# EAGLE schematic rep_ctrlr (EAGLE 6.2)
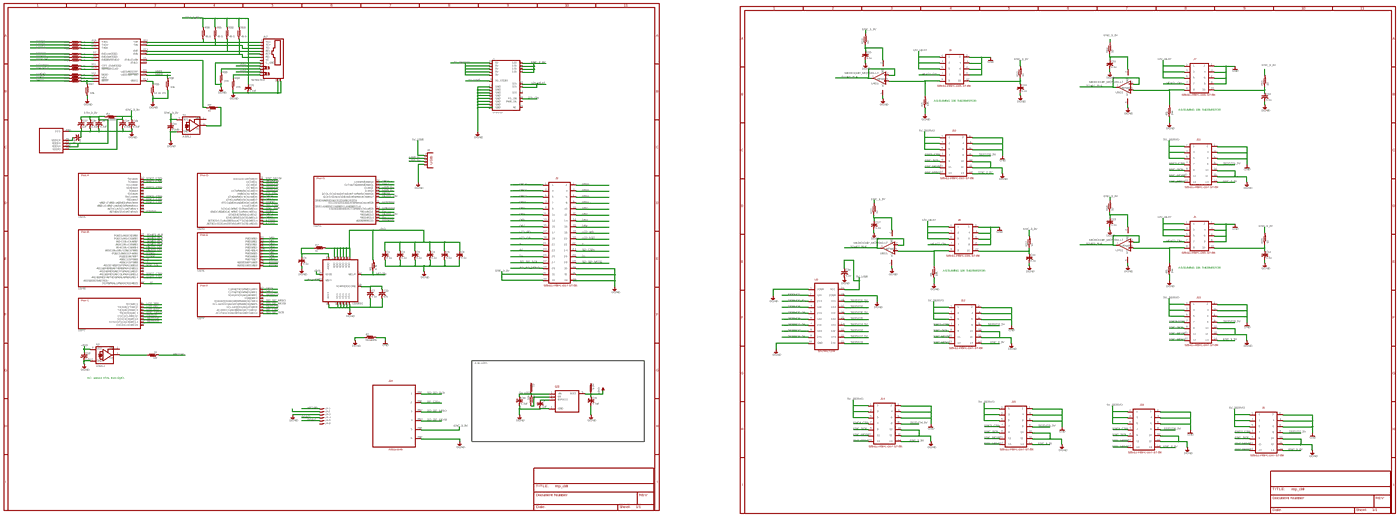
[diagram p0: schematic, sheet 1, overview]
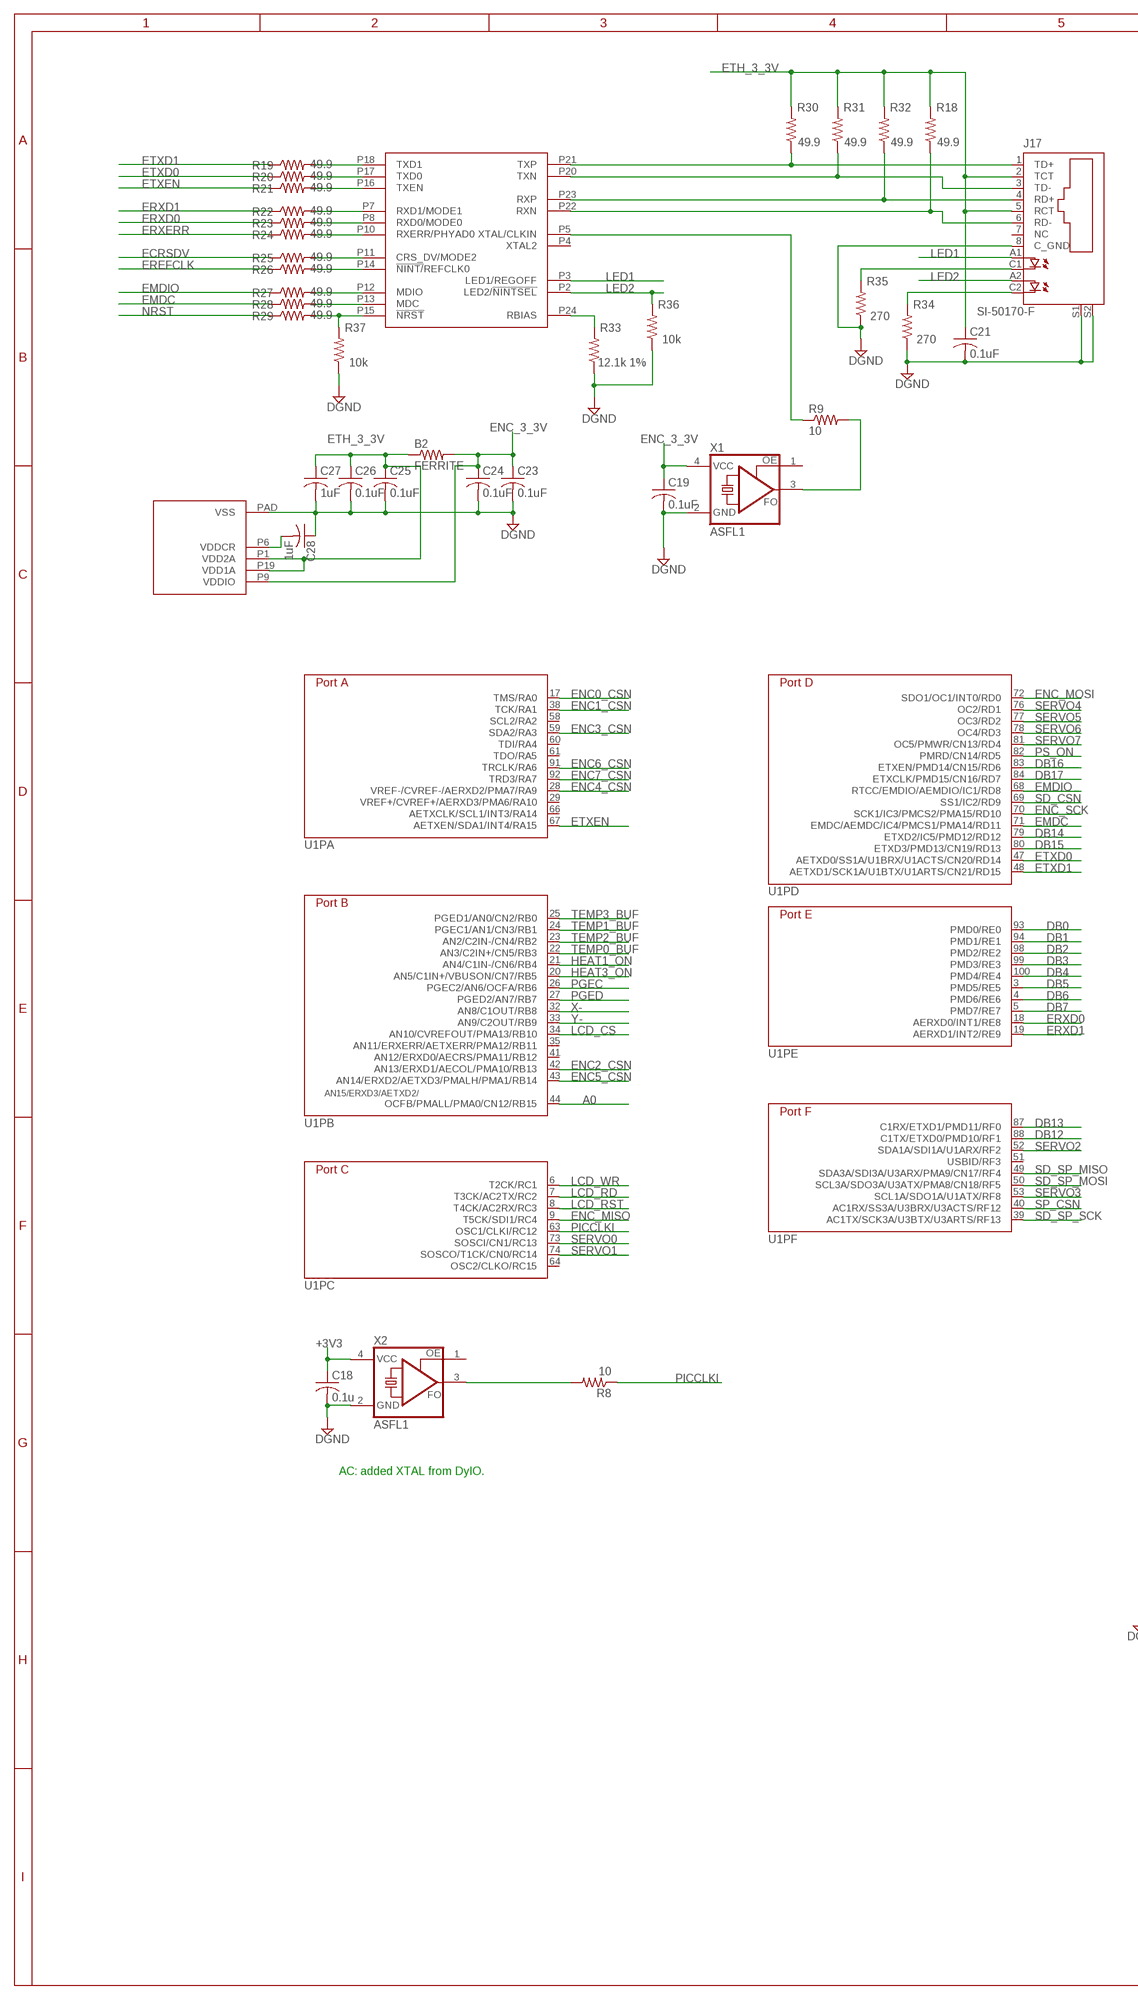
[diagram p1: schematic, sheet 1, part 1 of 4]
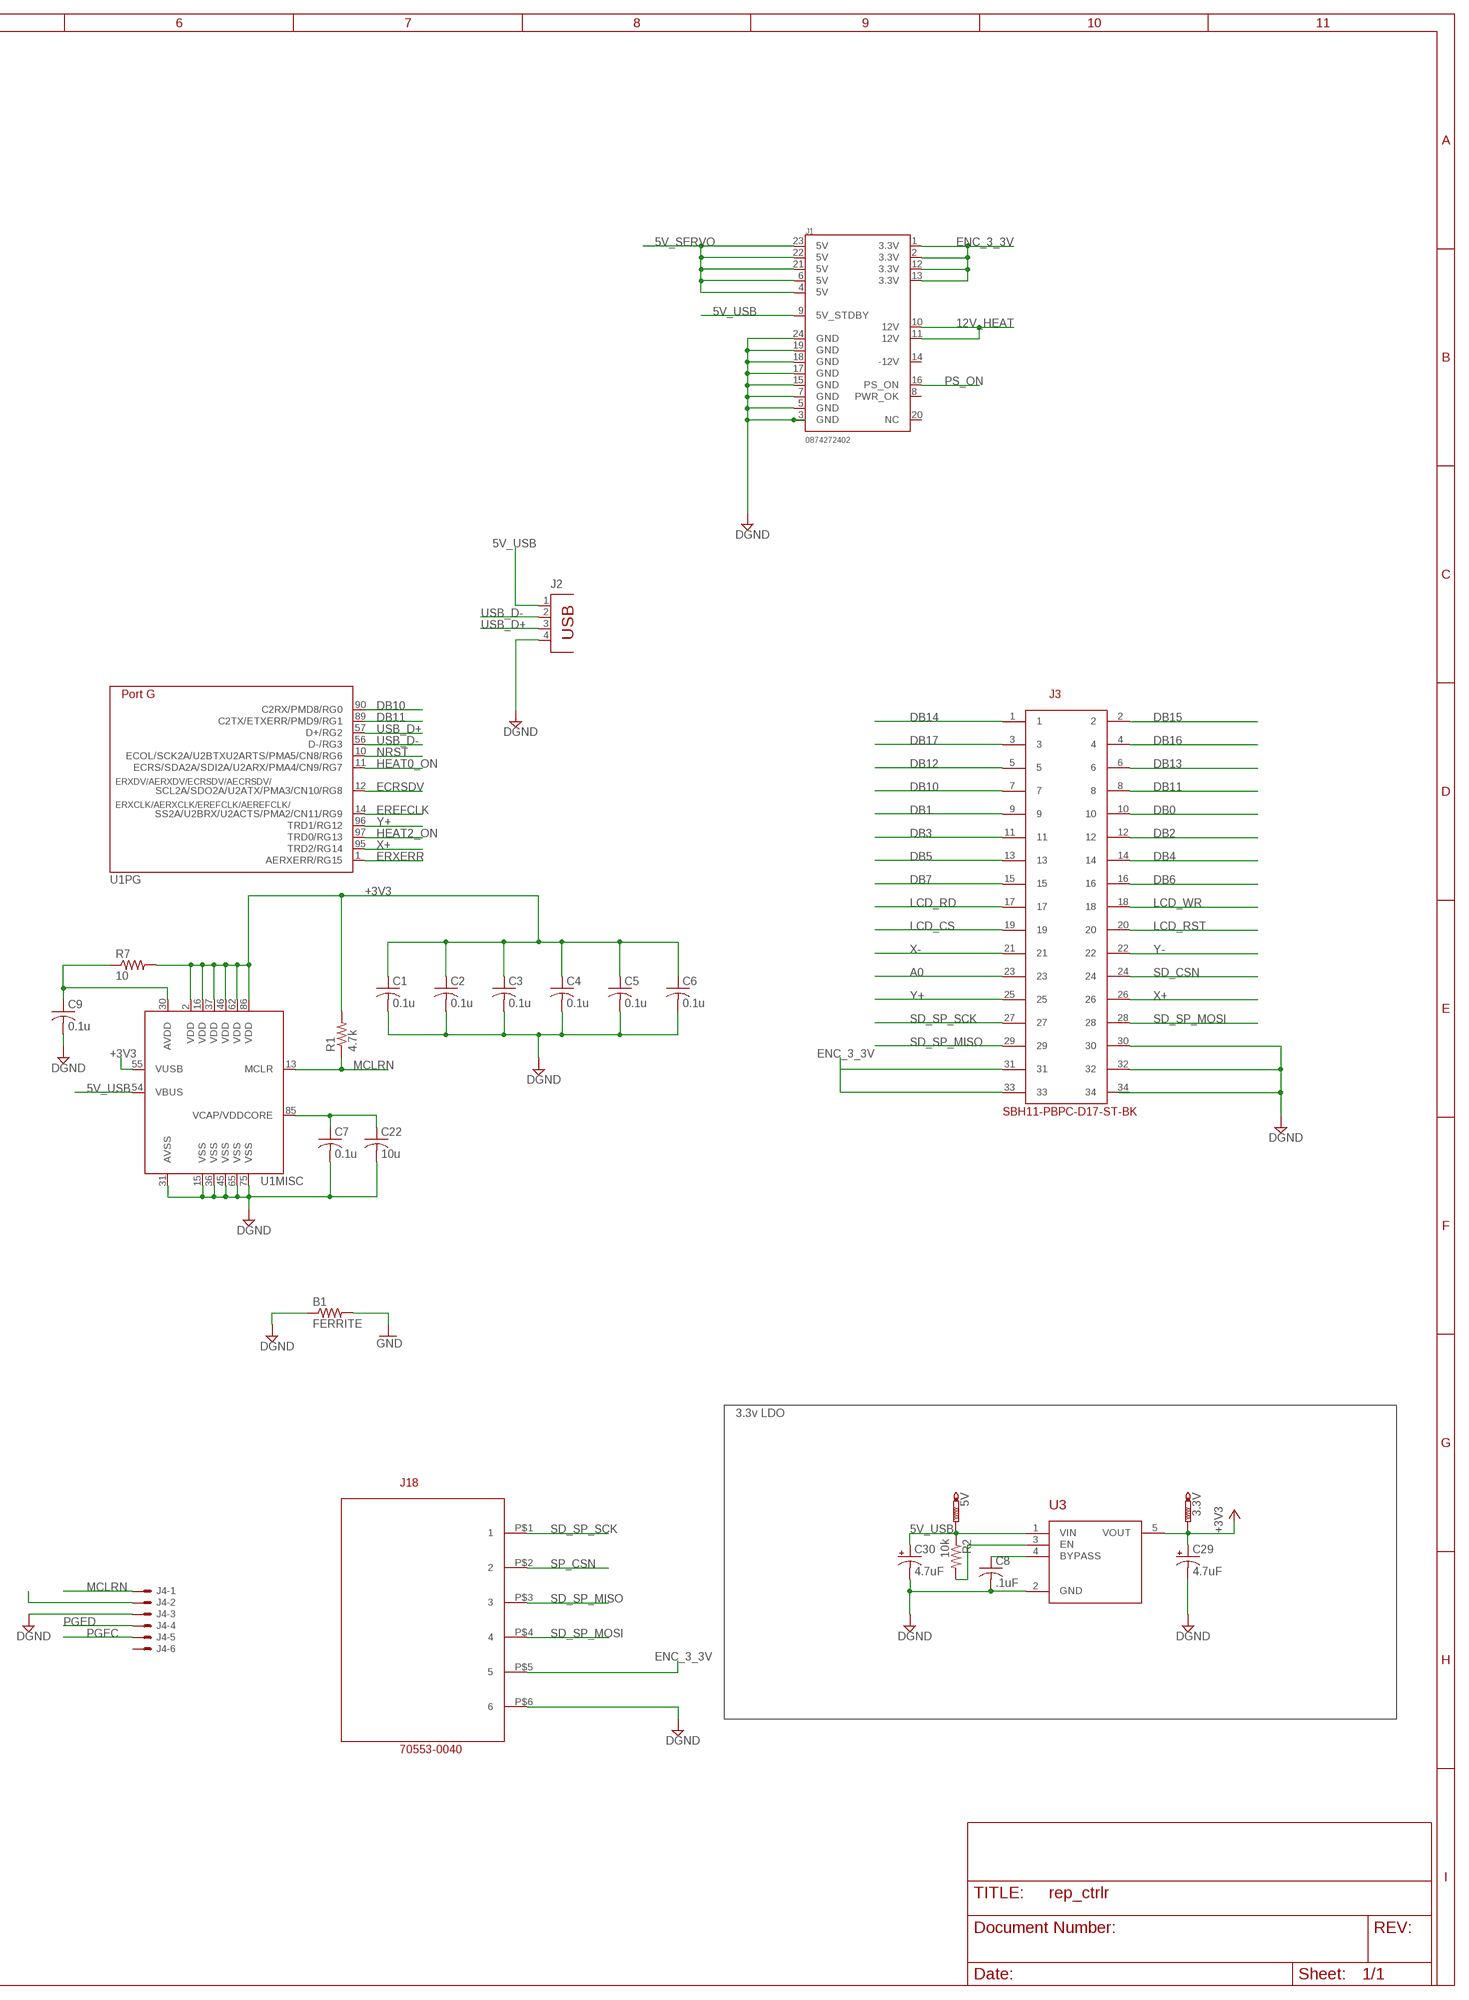
[diagram p2: schematic, sheet 1, part 2 of 4]
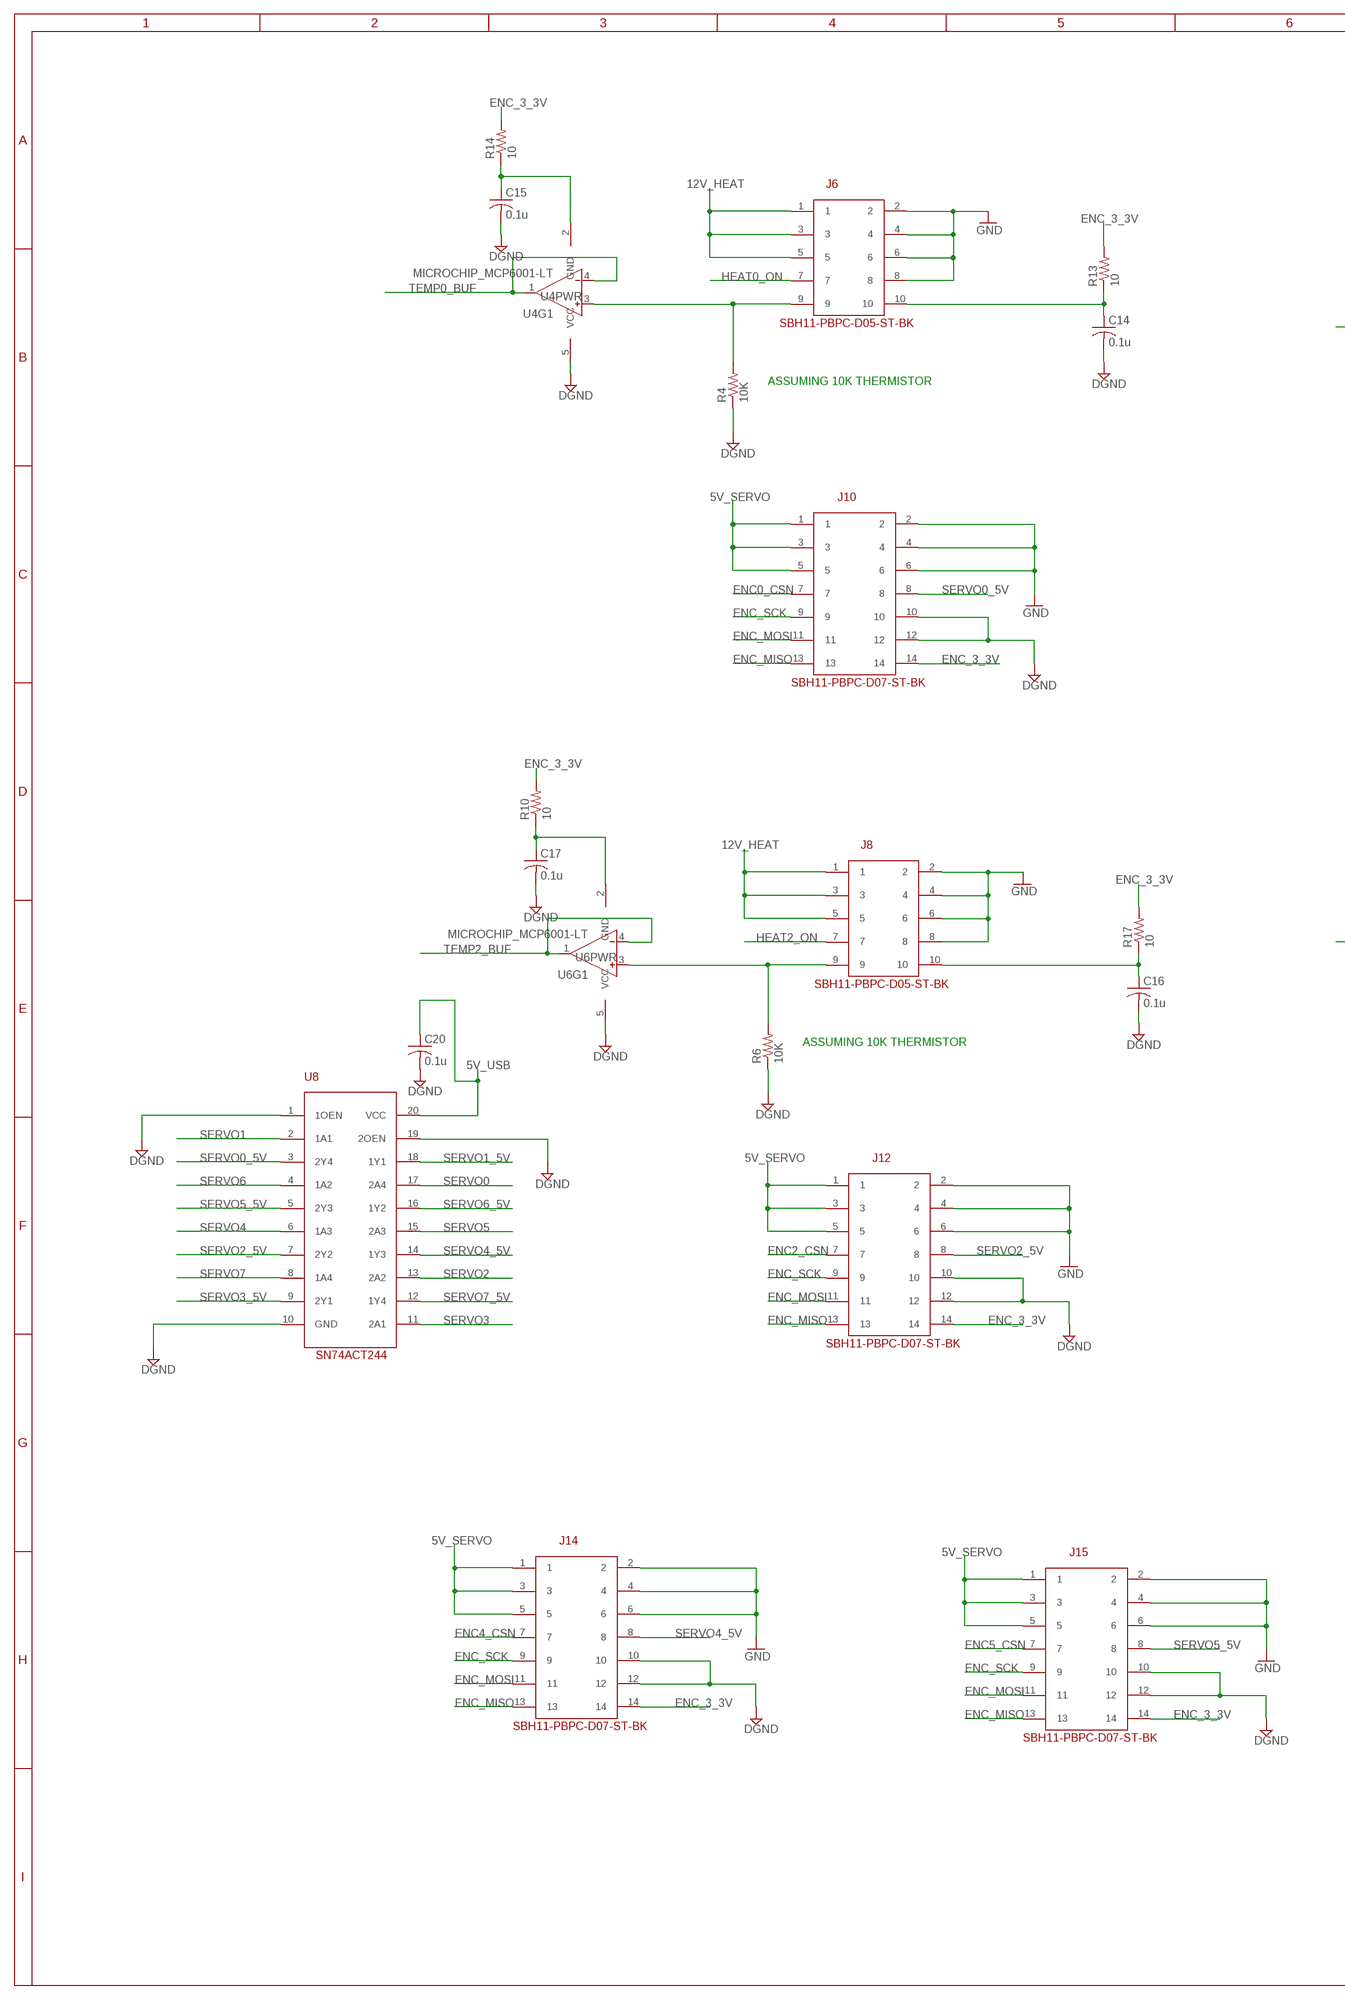
[diagram p3: schematic, sheet 1, part 3 of 4]
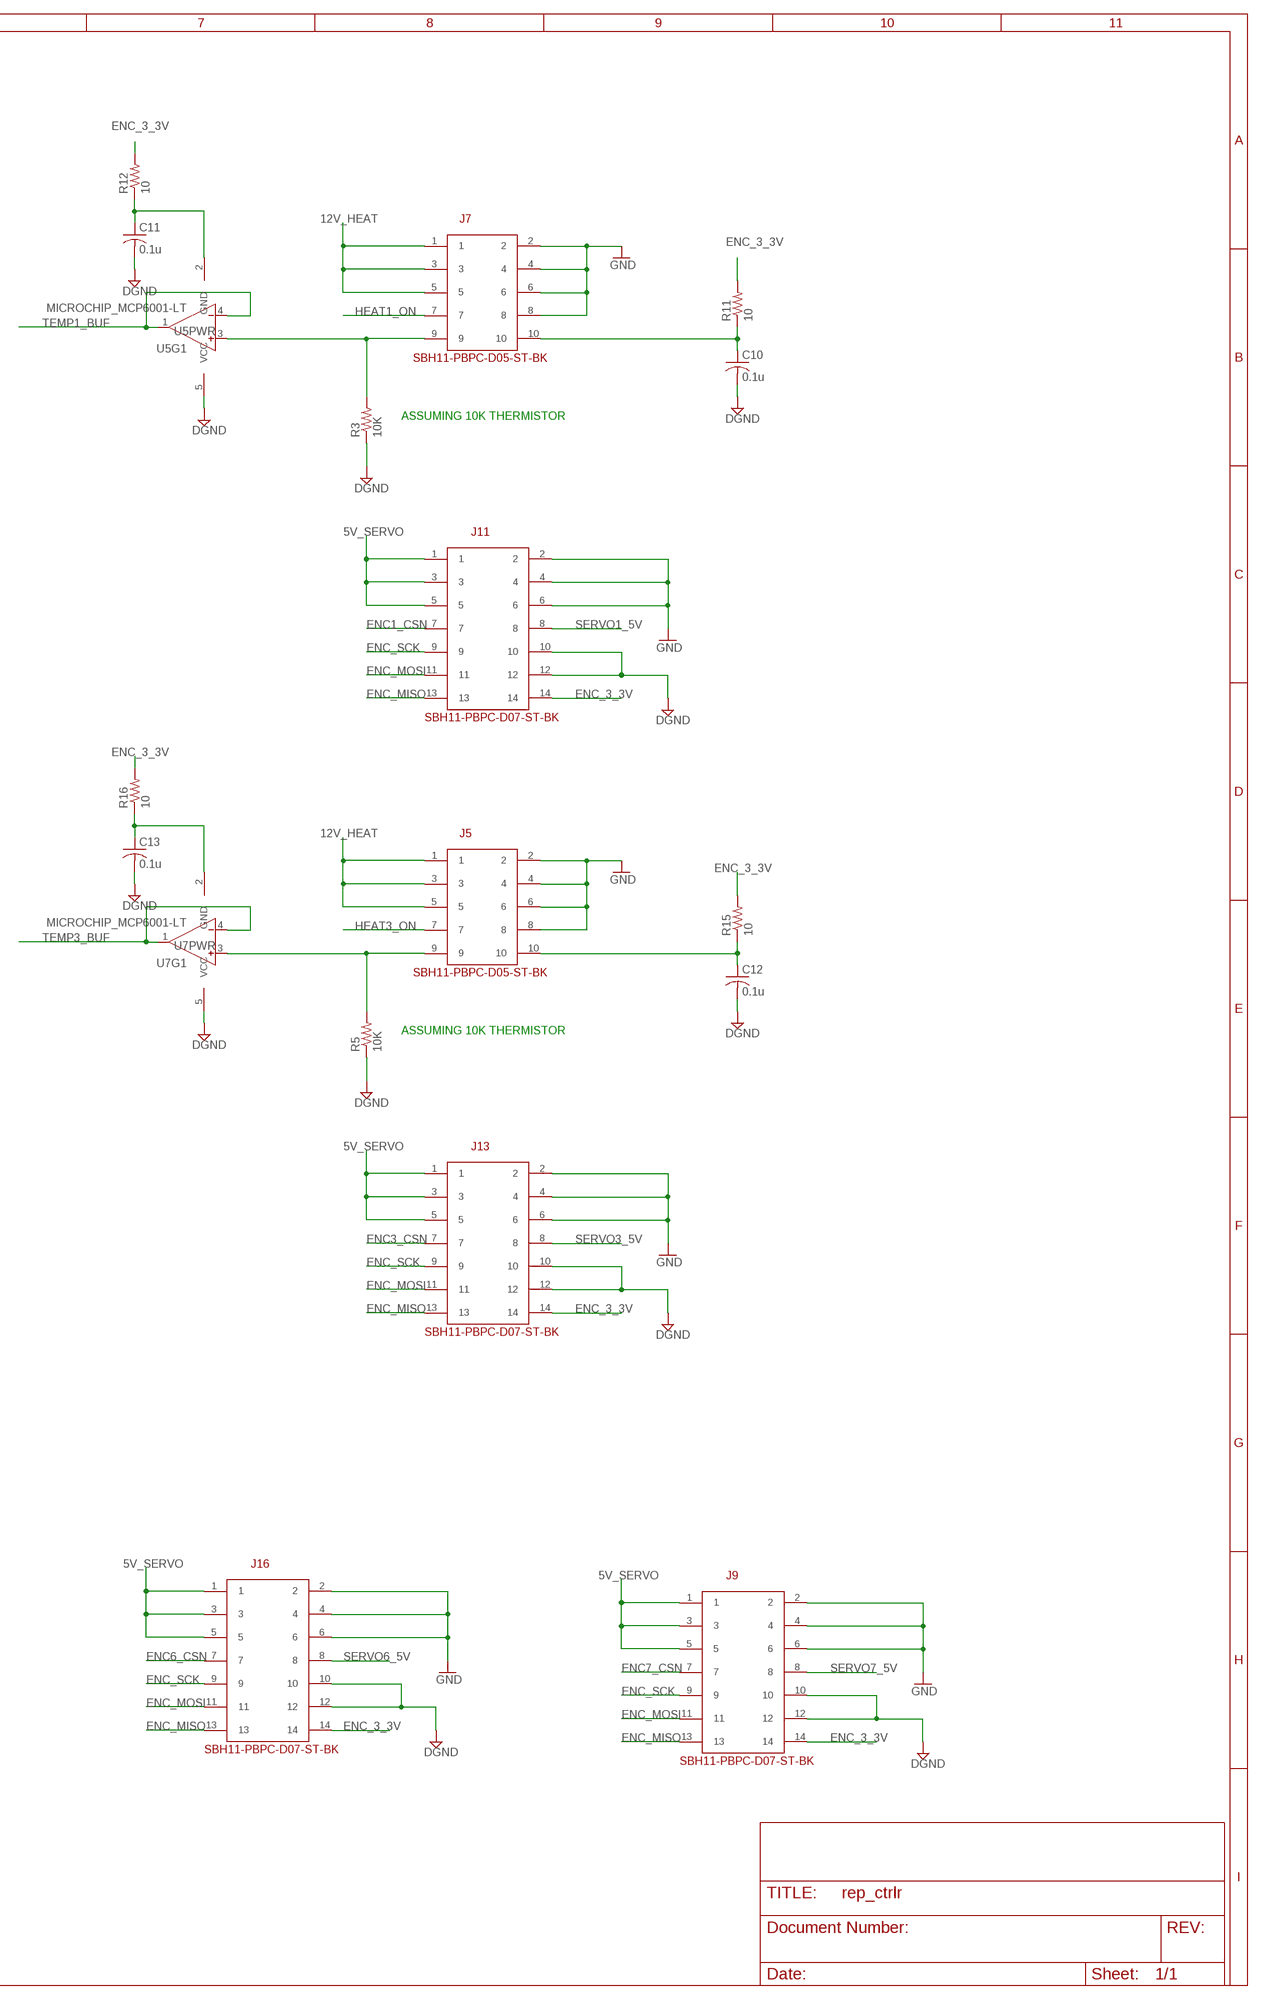
[diagram p4: schematic, sheet 1, part 4 of 4]

## Parts
3.3V  PTR1TP14R  [TP14R]
5V  PTR1TP14R  [TP14R]
B1  FERRITE  R-US_R0805  [R0805]
B2  FERRITE  R-US_R0805  [R0805]
C1  0.1u  C-USC0402  [C0402]
C2  0.1u  C-USC0402  [C0402]
C3  0.1u  C-USC0402  [C0402]
C4  0.1u  C-USC0402  [C0402]
C5  0.1u  C-USC0402  [C0402]
C6  0.1u  C-USC0402  [C0402]
C7  0.1u  C-USC0402  [C0402]
C8  .1uF  C-USC0402  [C0402@1]
C9  0.1u  C-USC0402  [C0402]
C10  0.1u  C-USC0402  [C0402]
C11  0.1u  C-USC0402  [C0402]
C12  0.1u  C-USC0402  [C0402]
C13  0.1u  C-USC0402  [C0402]
C14  0.1u  C-USC0402  [C0402]
C15  0.1u  C-USC0402  [C0402]
C16  0.1u  C-USC0402  [C0402]
C17  0.1u  C-USC0402  [C0402]
C18  0.1u  C-USC0402  [C0402]
C19  0.1uF  C-USC0402  [C0402]
C20  0.1u  C-USC0402  [C0402]
C21  0.1uF  C-USC0402  [C0402]
C22  10u  C-USC0603  [C0603]
C23  0.1uF  C-USC0603  [C0603]
C24  0.1uF  C-USC0603  [C0603]
C25  0.1uF  C-USC0603  [C0603]
C26  0.1uF  C-USC0603  [C0603]
C27  1uF  C-USC0603  [C0603]
C28  1uF  C-USC0603  [C0603]
C29  4.7uF  CPOL-USR/2012-12R  [R/2012-12R]
C30  4.7uF  CPOL-USR/2012-12R  [R/2012-12R]
J1  0874272402  ATX24RH  [ATX24_RIGHT_ANGLE]
J2  PN61729  [PN61729]
J3  SBH11-PBPC-D17-ST-BK  [SBH11-PBPC-D17-ST-BK]
J4  22-23-2061  [22-23-2061]
J5  SBH11-PBPC-D05-ST-BK  [SBH11-PBPC-D05-ST-BK]
J6  SBH11-PBPC-D05-ST-BK  [SBH11-PBPC-D05-ST-BK]
J7  SBH11-PBPC-D05-ST-BK  [SBH11-PBPC-D05-ST-BK]
J8  SBH11-PBPC-D05-ST-BK  [SBH11-PBPC-D05-ST-BK]
J9  SBH11-PBPC-D07-ST-BK  [SBH11-PBPC-D07-ST-BK]
J10  SBH11-PBPC-D07-ST-BK  [SBH11-PBPC-D07-ST-BK]
J11  SBH11-PBPC-D07-ST-BK  [SBH11-PBPC-D07-ST-BK]
J12  SBH11-PBPC-D07-ST-BK  [SBH11-PBPC-D07-ST-BK]
J13  SBH11-PBPC-D07-ST-BK  [SBH11-PBPC-D07-ST-BK]
J14  SBH11-PBPC-D07-ST-BK  [SBH11-PBPC-D07-ST-BK]
J15  SBH11-PBPC-D07-ST-BK  [SBH11-PBPC-D07-ST-BK]
J16  SBH11-PBPC-D07-ST-BK  [SBH11-PBPC-D07-ST-BK]
J17  SI-50170-F  SI-50170  [SI-50170]
J18  70553-0106  [70553-0109]
R1  4.7k  R-US_R0402  [R0402]
R2  10k  R-US_R0402  [R0402]
R3  10K  R-US_R0402  [R0402]
R4  10K  R-US_R0402  [R0402]
R5  10K  R-US_R0402  [R0402]
R6  10K  R-US_R0402  [R0402]
R7  10  R-US_R0402  [R0402]
R8  10  R-US_R0402  [R0402]
R9  10  R-US_R0402  [R0402]
R10  10  R-US_R0402  [R0402]
R11  10  R-US_R0402  [R0402]
R12  10  R-US_R0402  [R0402]
R13  10  R-US_R0402  [R0402]
R14  10  R-US_R0402  [R0402]
R15  10  R-US_R0402  [R0402]
R16  10  R-US_R0402  [R0402]
R17  10  R-US_R0402  [R0402]
R18  49.9  R-US_R0603  [R0603]
R19  49.9  R-US_R0603  [R0603]
R20  49.9  R-US_R0603  [R0603]
R21  49.9  R-US_R0603  [R0603]
R22  49.9  R-US_R0603  [R0603]
R23  49.9  R-US_R0603  [R0603]
R24  49.9  R-US_R0603  [R0603]
R25  49.9  R-US_R0603  [R0603]
R26  49.9  R-US_R0603  [R0603]
R27  49.9  R-US_R0603  [R0603]
R28  49.9  R-US_R0603  [R0603]
R29  49.9  R-US_R0603  [R0603]
R30  49.9  R-US_R0603  [R0603]
R31  49.9  R-US_R0603  [R0603]
R32  49.9  R-US_R0603  [R0603]
R33  12.1k 1%  R-US_R0603  [R0603]
R34  270  R-US_R0603  [R0603]
R35  270  R-US_R0603  [R0603]
R36  10k  R-US_R0603  [R0603]
R37  10k  R-US_R0603  [R0603]
U1  MICROCHIP_PIC32MX7X5F256L-PF  [MICROCHIP_TQ100-PF]
U2  8720A_PHY  [QFN24]
U3  LDS3985XX33  [SOT23-5]
U4  MICROCHIP_MCP6001-LT  [MICROCHIP_SC70-5-LT]
U5  MICROCHIP_MCP6001-LT  [MICROCHIP_SC70-5-LT]
U6  MICROCHIP_MCP6001-LT  [MICROCHIP_SC70-5-LT]
U7  MICROCHIP_MCP6001-LT  [MICROCHIP_SC70-5-LT]
U8  SN74ACT244  [20-SOIC]
X1  ASFL1  [ASF]
X2  ASFL1  [ASF]

## Nets
5V_SERVO: J1.4(5V) J1.6(5V) J1.21(5V) J1.22(5V) J1.23(5V) J9.1 J9.3 J9.5 J10.1 J10.3 J10.5 J11.1 J11.3 J11.5 J12.1 J12.3 J12.5 J13.1 J13.3 J13.5 J14.1 J14.3 J14.5 J15.1 J15.3 J15.5 J16.1 J16.3 J16.5
5V_USB: 5V.TP C20.1 C30.+ J1.9(5V_STDBY) J2.1 R2.1 U1.54(MISC:VBUS) U3.1(VIN) U8.20(VCC)
12V_HEAT: J1.10(12V) J1.11(12V) J5.1 J5.3 J5.5 J6.1 J6.3 J6.5 J7.1 J7.3 J7.5 J8.1 J8.3 J8.5
+3V3: 3.3V.TP C1.1 C2.1 C3.1 C4.1 C5.1 C6.1 C18.1 C29.+ J4.2 R1.2 R7.2 U1.2(MISC:VDD) U1.16(MISC:VDD) U1.37(MISC:VDD) U1.46(MISC:VDD) U1.55(MISC:VUSB) U1.62(MISC:VDD) U1.86(MISC:VDD) U3.5(VOUT) X2.4(VCC)
A0: J3.23 U1.44(PB:OCFB/PMALL/PMA0/CN12/RB15)
DB0: J3.10 U1.93(PE:PMD0/RE0)
DB1: J3.9 U1.94(PE:PMD1/RE1)
DB2: J3.12 U1.98(PE:PMD2/RE2)
DB3: J3.11 U1.99(PE:PMD3/RE3)
DB4: J3.14 U1.100(PE:PMD4/RE4)
DB5: J3.13 U1.3(PE:PMD5/RE5)
DB6: J3.16 U1.4(PE:PMD6/RE6)
DB7: J3.15 U1.5(PE:PMD7/RE7)
DB10: J3.7 U1.90(PG:C2RX/PMD8/RG0)
DB11: J3.8 U1.89(PG:C2TX/ETXERR/PMD9/RG1)
DB12: J3.5 U1.88(PF:C1TX/ETXD0/PMD10/RF1)
DB13: J3.6 U1.87(PF:C1RX/ETXD1/PMD11/RF0)
DB14: J3.1 U1.79(PD:ETXD2/IC5/PMD12/RD12)
DB15: J3.2 U1.80(PD:ETXD3/PMD13/CN19/RD13)
DB16: J3.4 U1.83(PD:ETXEN/PMD14/CN15/RD6)
DB17: J3.3 U1.84(PD:ETXCLK/PMD15/CN16/RD7)
DGND: B1.1 C1.2 C2.2 C3.2 C4.2 C5.2 C6.2 C7.2 C8.2 C9.2 C10.2 C11.2 C12.2 C13.2 C14.2 C15.2 C16.2 C17.2 C18.2 C19.2 C20.2 C21.2 C22.2 C23.2 C24.2 C25.2 C26.2 C27.2 C28.1 C29.- C30.- J1.3(GND) J1.5(GND) J1.7(GND) J1.15(GND) J1.17(GND) J1.18(GND) J1.19(GND) J1.24(GND) J2.4 J3.30 J3.32 J4.3 J9.10 J9.12 J10.10 J10.12 J11.10 J11.12 J12.10 J12.12 J13.10 J13.12 J14.10 J14.12 J15.10 J15.12 J16.10 J16.12 J17.8(C_GND) J17.S1 J17.S2 J18.P$6 R3.1 R4.1 R5.1 R6.1 R33.1 R34.1 R35.1 R36.1 R37.1 U1.15(MISC:VSS) U1.31(MISC:AVSS) U1.36(MISC:VSS) U1.45(MISC:VSS) U1.65(MISC:VSS) U1.75(MISC:VSS) U2.PAD(VSS) U3.2(GND) U4.5(PWR:VCC) U5.5(PWR:VCC) U6.5(PWR:VCC) U7.5(PWR:VCC) U8.1(1OEN) U8.10(GND) U8.19(2OEN) X1.2(GND) X2.2(GND)
ECRSDV: R25.1 U1.12(PG:SCL2A/SDO2A/U2ATX/PMA3/CN10/RG8)
EMDC: R28.1 U1.71(PD:EMDC/AEMDC/IC4/PMCS1/PMA14/RD11)
EMDIO: R27.1 U1.68(PD:RTCC/EMDIO/AEMDIO/IC1/RD8)
ENC0_CSN: J10.7 U1.17(PA:TMS/RA0)
ENC1_CSN: J11.7 U1.38(PA:TCK/RA1)
ENC2_CSN: J12.7 U1.42(PB:AN13/ERXD1/AECOL/PMA10/RB13)
ENC3_CSN: J13.7 U1.59(PA:SDA2/RA3)
ENC4_CSN: J14.7 U1.28(PA:VREF-/CVREF-/AERXD2/PMA7/RA9)
ENC5_CSN: J15.7 U1.43(PB:AN14/ERXD2/AETXD3/PMALH/PMA1/RB14)
ENC6_CSN: J16.7 U1.91(PA:TRCLK/RA6)
ENC7_CSN: J9.7 U1.92(PA:TRD3/RA7)
ENC_3_3V: B2.2 C19.1 C23.1 C24.1 J1.1(3.3V) J1.2(3.3V) J1.12(3.3V) J1.13(3.3V) J3.31 J3.33 J9.14 J10.14 J11.14 J12.14 J13.14 J14.14 J15.14 J16.14 J18.P$5 R10.2 R11.2 R12.2 R13.2 R14.2 R15.2 R16.2 R17.2 U2.P9(VDDIO) X1.4(VCC)
ENC_MISO: J9.13 J10.13 J11.13 J12.13 J13.13 J14.13 J15.13 J16.13 U1.9(PC:T5CK/SDI1/RC4)
ENC_MOSI: J9.11 J10.11 J11.11 J12.11 J13.11 J14.11 J15.11 J16.11 U1.72(PD:SDO1/OC1/INT0/RD0)
ENC_SCK: J9.9 J10.9 J11.9 J12.9 J13.9 J14.9 J15.9 J16.9 U1.70(PD:SCK1/IC3/PMCS2/PMA15/RD10)
EREFCLK: R26.1 U1.14(PG:SS2A/U2BRX/U2ACTS/PMA2/CN11/RG9)
ERXD0: R23.1 U1.18(PE:AERXD0/INT1/RE8)
ERXD1: R22.1 U1.19(PE:AERXD1/INT2/RE9)
ERXERR: R24.1 U1.1(PG:AERXERR/RG15)
ETH_3_3V: B2.1 C25.1 C26.1 C27.1 J17.2(TCT) J17.5(RCT) R18.2 R30.2 R31.2 R32.2 U2.P1(VDD2A) U2.P19(VDD1A)
ETXD0: R20.1 U1.47(PD:AETXD0/SS1A/U1BRX/U1ACTS/CN20/RD14)
ETXD1: R19.1 U1.48(PD:AETXD1/SCK1A/U1BTX/U1ARTS/CN21/RD15)
ETXEN: R21.1 U1.67(PA:AETXEN/SDA1/INT4/RA15)
GND: B1.2 J5.2 J5.4 J5.6 J5.8 J6.2 J6.4 J6.6 J6.8 J7.2 J7.4 J7.6 J7.8 J8.2 J8.4 J8.6 J8.8 J9.2 J9.4 J9.6 J10.2 J10.4 J10.6 J11.2 J11.4 J11.6 J12.2 J12.4 J12.6 J13.2 J13.4 J13.6 J14.2 J14.4 J14.6 J15.2 J15.4 J15.6 J16.2 J16.4 J16.6
HEAT0_ON: J6.7 U1.11(PG:ECRS/SDA2A/SDI2A/U2ARX/PMA4/CN9/RG7)
HEAT1_ON: J7.7 U1.21(PB:AN4/C1IN-/CN6/RB4)
HEAT2_ON: J8.7 U1.97(PG:TRD0/RG13)
HEAT3_ON: J5.7 U1.20(PB:AN5/C1IN+/VBUSON/CN7/RB5)
LCD_CS: J3.19 U1.34(PB:AN10/CVREFOUT/PMA13/RB10)
LCD_RD: J3.17 U1.7(PC:T3CK/AC2TX/RC2)
LCD_RST: J3.20 U1.8(PC:T4CK/AC2RX/RC3)
LCD_WR: J3.18 U1.6(PC:T2CK/RC1)
LED1: J17.A1(A) U2.P3(LED1/REGOFF)
LED2: J17.A2(A1) R36.2 U2.P2(LED2/!NINTSEL)
MCLRN: J4.1 R1.1 U1.13(MISC:MCLR)
N$1: R8.2 X2.3(FO)
N$2: C9.1 R7.1 U1.30(MISC:AVDD)
N$4: R9.2 X1.3(FO)
N$5: C7.1 C22.1 U1.85(MISC:VCAP/VDDCORE)
N$9: J7.9 R3.2 U5.3(IN+)
N$11: J5.9 R5.2 U7.3(IN+)
N$12: C12.1 J5.10 R15.1
N$13: C10.1 J7.10 R11.1
N$14: C11.1 R12.1 U5.2(PWR:GND)
N$15: C13.1 R16.1 U7.2(PWR:GND)
N$16: J6.9 R4.2 U4.3(IN+)
N$17: C14.1 J6.10 R13.1
N$18: C15.1 R14.1 U4.2(PWR:GND)
N$19: J8.9 R6.2 U6.3(IN+)
N$20: C16.1 J8.10 R17.1
N$21: C17.1 R10.1 U6.2(PWR:GND)
N$23: R19.2 U2.P18(TXD1)
N$24: R20.2 U2.P17(TXD0)
N$25: R21.2 U2.P16(TXEN)
N$26: R22.2 U2.P7(RXD1/MODE1)
N$27: R23.2 U2.P8(RXD0/MODE0)
N$28: R24.2 U2.P10(RXERR/PHYAD0)
N$29: R25.2 U2.P11(CRS_DV/MODE2)
N$30: R26.2 U2.P14(!NINT/!REFCLK0)
N$31: R27.2 U2.P12(MDIO)
N$32: R28.2 U2.P13(MDC)
N$33: R29.2 R37.2 U2.P15(!NRST)
N$34: J17.1(TD+) R30.1 U2.P21(TXP)
N$35: J17.3(TD-) R31.1 U2.P20(TXN)
N$36: J17.4(RD+) R32.1 U2.P23(RXP)
N$37: J17.6(RD-) R18.1 U2.P22(RXN)
N$38: R9.1 U2.P5(XTAL/CLKIN)
N$40: R2.2 U3.3(EN)
N$41: C8.1 U3.4(BYPASS)
N$42: J17.C1(C) R35.2
N$43: J17.C2(C1) R34.2
N$44: C28.2 U2.P6(VDDCR)
N$52: R33.2 U2.P24(RBIAS)
NRST: R29.1 U1.10(PG:ECOL/SCK2A/U2BTXU2ARTS/PMA5/CN8/RG6)
PGEC: J4.5 U1.26(PB:PGEC2/AN6/OCFA/RB6)
PGED: J4.4 U1.27(PB:PGED2/AN7/RB7)
PICCLKI: R8.1 U1.63(PC:OSC1/CLKI/RC12)
PS_ON: J1.16(PS_ON) U1.82(PD:PMRD/CN14/RD5)
SD_CSN: J3.24 U1.69(PD:SS1/IC2/RD9)
SD_SP_MISO: J3.29 J18.P$3 U1.49(PF:SDA3A/SDI3A/U3ARX/PMA9/CN17/RF4)
SD_SP_MOSI: J3.28 J18.P$4 U1.50(PF:SCL3A/SDO3A/U3ATX/PMA8/CN18/RF5)
SD_SP_SCK: J3.27 J18.P$1 U1.39(PF:AC1TX/SCK3A/U3BTX/U3ARTS/RF13)
SERVO0: U1.73(PC:SOSCI/CN1/RC13) U8.17(2A4)
SERVO0_5V: J10.8 U8.3(2Y4)
SERVO1: U1.74(PC:SOSCO/T1CK/CN0/RC14) U8.2(1A1)
SERVO1_5V: J11.8 U8.18(1Y1)
SERVO2: U1.52(PF:SDA1A/SDI1A/U1ARX/RF2) U8.13(2A2)
SERVO2_5V: J12.8 U8.7(2Y2)
SERVO3: U1.53(PF:SCL1A/SDO1A/U1ATX/RF8) U8.11(2A1)
SERVO3_5V: J13.8 U8.9(2Y1)
SERVO4: U1.76(PD:OC2/RD1) U8.6(1A3)
SERVO4_5V: J14.8 U8.14(1Y3)
SERVO5: U1.77(PD:OC3/RD2) U8.15(2A3)
SERVO5_5V: J15.8 U8.5(2Y3)
SERVO6: U1.78(PD:OC4/RD3) U8.4(1A2)
SERVO6_5V: J16.8 U8.16(1Y2)
SERVO7: U1.81(PD:OC5/PMWR/CN13/RD4) U8.8(1A4)
SERVO7_5V: J9.8 U8.12(1Y4)
SP_CSN: J18.P$2 U1.40(PF:AC1RX/SS3A/U3BRX/U3ACTS/RF12)
TEMP0_BUF: U1.22(PB:AN3/C2IN+/CN5/RB3) U4.1(OUT) U4.4(IN-)
TEMP1_BUF: U1.24(PB:PGEC1/AN1/CN3/RB1) U5.1(OUT) U5.4(IN-)
TEMP2_BUF: U1.23(PB:AN2/C2IN-/CN4/RB2) U6.1(OUT) U6.4(IN-)
TEMP3_BUF: U1.25(PB:PGED1/AN0/CN2/RB0) U7.1(OUT) U7.4(IN-)
USB_D+: J2.3 U1.57(PG:D+/RG2)
USB_D-: J2.2 U1.56(PG:D-/RG3)
X+: J3.26 U1.95(PG:TRD2/RG14)
X-: J3.21 U1.32(PB:AN8/C1OUT/RB8)
Y+: J3.25 U1.96(PG:TRD1/RG12)
Y-: J3.22 U1.33(PB:AN9/C2OUT/RB9)
Unconnected: C21.1 J1.8(PWR_OK) J1.14(-12V) J1.20(NC) J3.34 J4.6 J17.7(NC) U1.29(PA:VREF+/CVREF+/AERXD3/PMA6/RA10) U1.35(PB:AN11/ERXERR/AETXERR/PMA12/RB11) U1.41(PB:AN12/ERXD0/AECRS/PMA11/RB12) U1.51(PF:USBID/RF3) U1.58(PA:SCL2/RA2) U1.60(PA:TDI/RA4) U1.61(PA:TDO/RA5) U1.64(PC:OSC2/CLKO/RC15) U1.66(PA:AETXCLK/SCL1/INT3/RA14) U2.P4(XTAL2) X1.1(OE) X2.1(OE)

## Notes on the sheet
- ASSUMING 10K THERMISTOR
- ASSUMING 10K THERMISTOR
- ASSUMING 10K THERMISTOR
- ASSUMING 10K THERMISTOR
- 3.3v LDO
- AC: added XTAL from DyIO.

## Library data of the parts
3.3V 5V = testpad:PTR1: TEST PIN
B1 B2 R1 R3-R37 = resistor:R-US_: RESISTOR, American symbol
C1-C7 C9-C28 = resistor:C-US: CAPACITOR, American symbol
C8 = rcl:C-US: CAPACITOR, American symbol
C29 C30 = rcl:CPOL-US: POLARIZED CAPACITOR, American symbol
J1 = SparkFun-Connectors:ATX24: ATX24 Pin Power Supply Connector This is a good connector for connecting a computer power supply to a PCB. It's massive, but provides many amps of power at 5V and 12V. SKU: PRT-09498
J2 = con-berg:PN61729: BERG USB connector; OC_FARNELL: unknown; OC_NEWARK: unknown
J3 = SBH11-PBPC-D17-ST-BK:SBH11-PBPC-D17-ST-BK
J4 = con-molex:22-23-2061: .100" (2.54mm) Center Header - 6 Pin; MF: MOLEX; MPN: 22-23-2061; OC_FARNELL: 1462922; OC_NEWARK: 27C1933
J5-J8 = SBH11-PBPC-D05-ST-BK:SBH11-PBPC-D05-ST-BK
J9-J16 = SBH11-PBPC-D07-ST-BK:SBH11-PBPC-D07-ST-BK
J17 = con-stewart:SI-50170: Ethernet Connector MagJack (R) Source: www.stewartconnector.com .. si-50170.pdf; OC_FARNELL: unknown; OC_NEWARK: unknown
J18 = 70553-0109:70553-0106
R2 = rcl:R-US_: RESISTOR, American symbol
U1 = chipKIT_Max32:MICROCHIP_PIC32MX7X5F*L: High Performance, USB, CAN and Ethernet 32-Bit Flash Microcontroller
U2 = SMSC8720a_Ethernet_PHY:8720A_PHY: Small Footprint, Low Power Consumption, Full-Featured 10/100 Ethernet Transceivers SMSC's LAN8710A and LAN8720A are high-performance, small-footprint, low-power 10BASE-T/100BASE-TX transceivers specifically designed for today's consumer electronics, industrial and enterprise applications. The LAN8710A/8720A are the industry's smallest footprint solutions with up to 40% lower power consumption than existing SMSC transceivers. The LAN8710A/8720A have an integrated voltage regulator and ESD protection components to help reduce Bill of Material (BOM) costs. The LAN8710A connects to the MAC layer using a variable voltage, digital standard MII or RMII interface, while the LAN8720A connects via an RMII interface. Both devices support HP Auto-MDIX†, employ SMSC's proprietary flexPWR technology and are available in both extended commercial (0° to 85°C) and industrial (-40° to 85°C) temperature range options. SMSC's complimentary and confidential LANCheck® online design review service is available for customers who have selected our products for their application design-in*. Footprint made by Alex Camilo. CC BY SA
U3 = LDS3985XX33:LDS3985XX33
U4-U7 = chipKIT_Max32:MICROCHIP_MCP6001: 1 Mhz Low Power Op Amp
U8 = SN74ACT244:SN74ACT244
X1 X2 = crystal:ASF*: CRYSTAL CLOCK OSCILLATORS 5.0 Vdc or 3.3 Vdc - LOW PROFILE ULTRA MINIATURE CERAMIC SURFACE MOUNT Source: http://www.abracon.com/Oscillators/asf1-L-L1.pdf; MF: Abracon Corporation; MPN: ASFL1-125.000MHZ-EC-T; OC_FARNELL: 1838931; OC_NEWARK: 19M1882